# EAGLE board ESP32-P4 Display 7.0 inch V1.0 (EAGLE 9.6.2), part 1 of 3
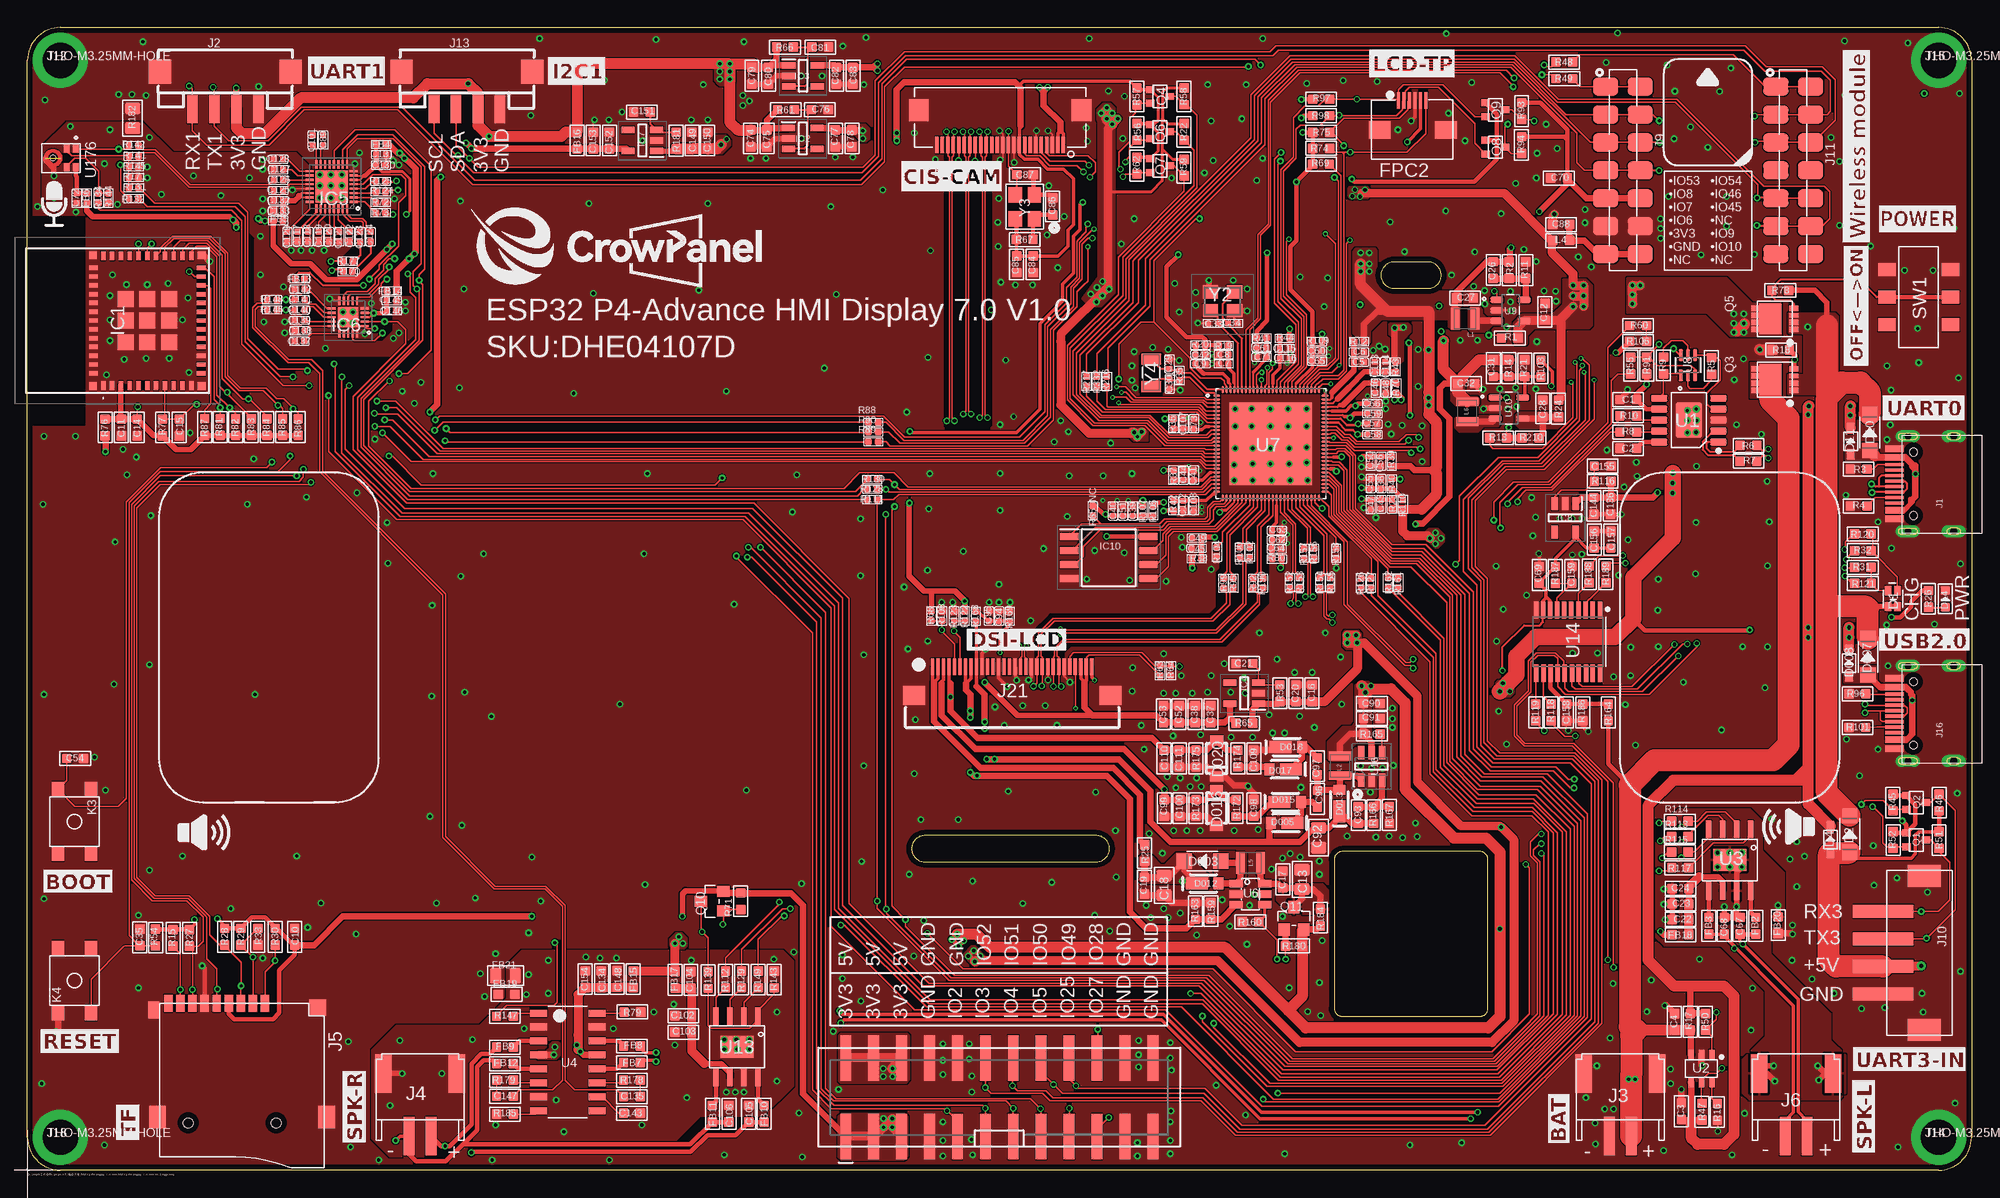
[diagram p9: board, top side]
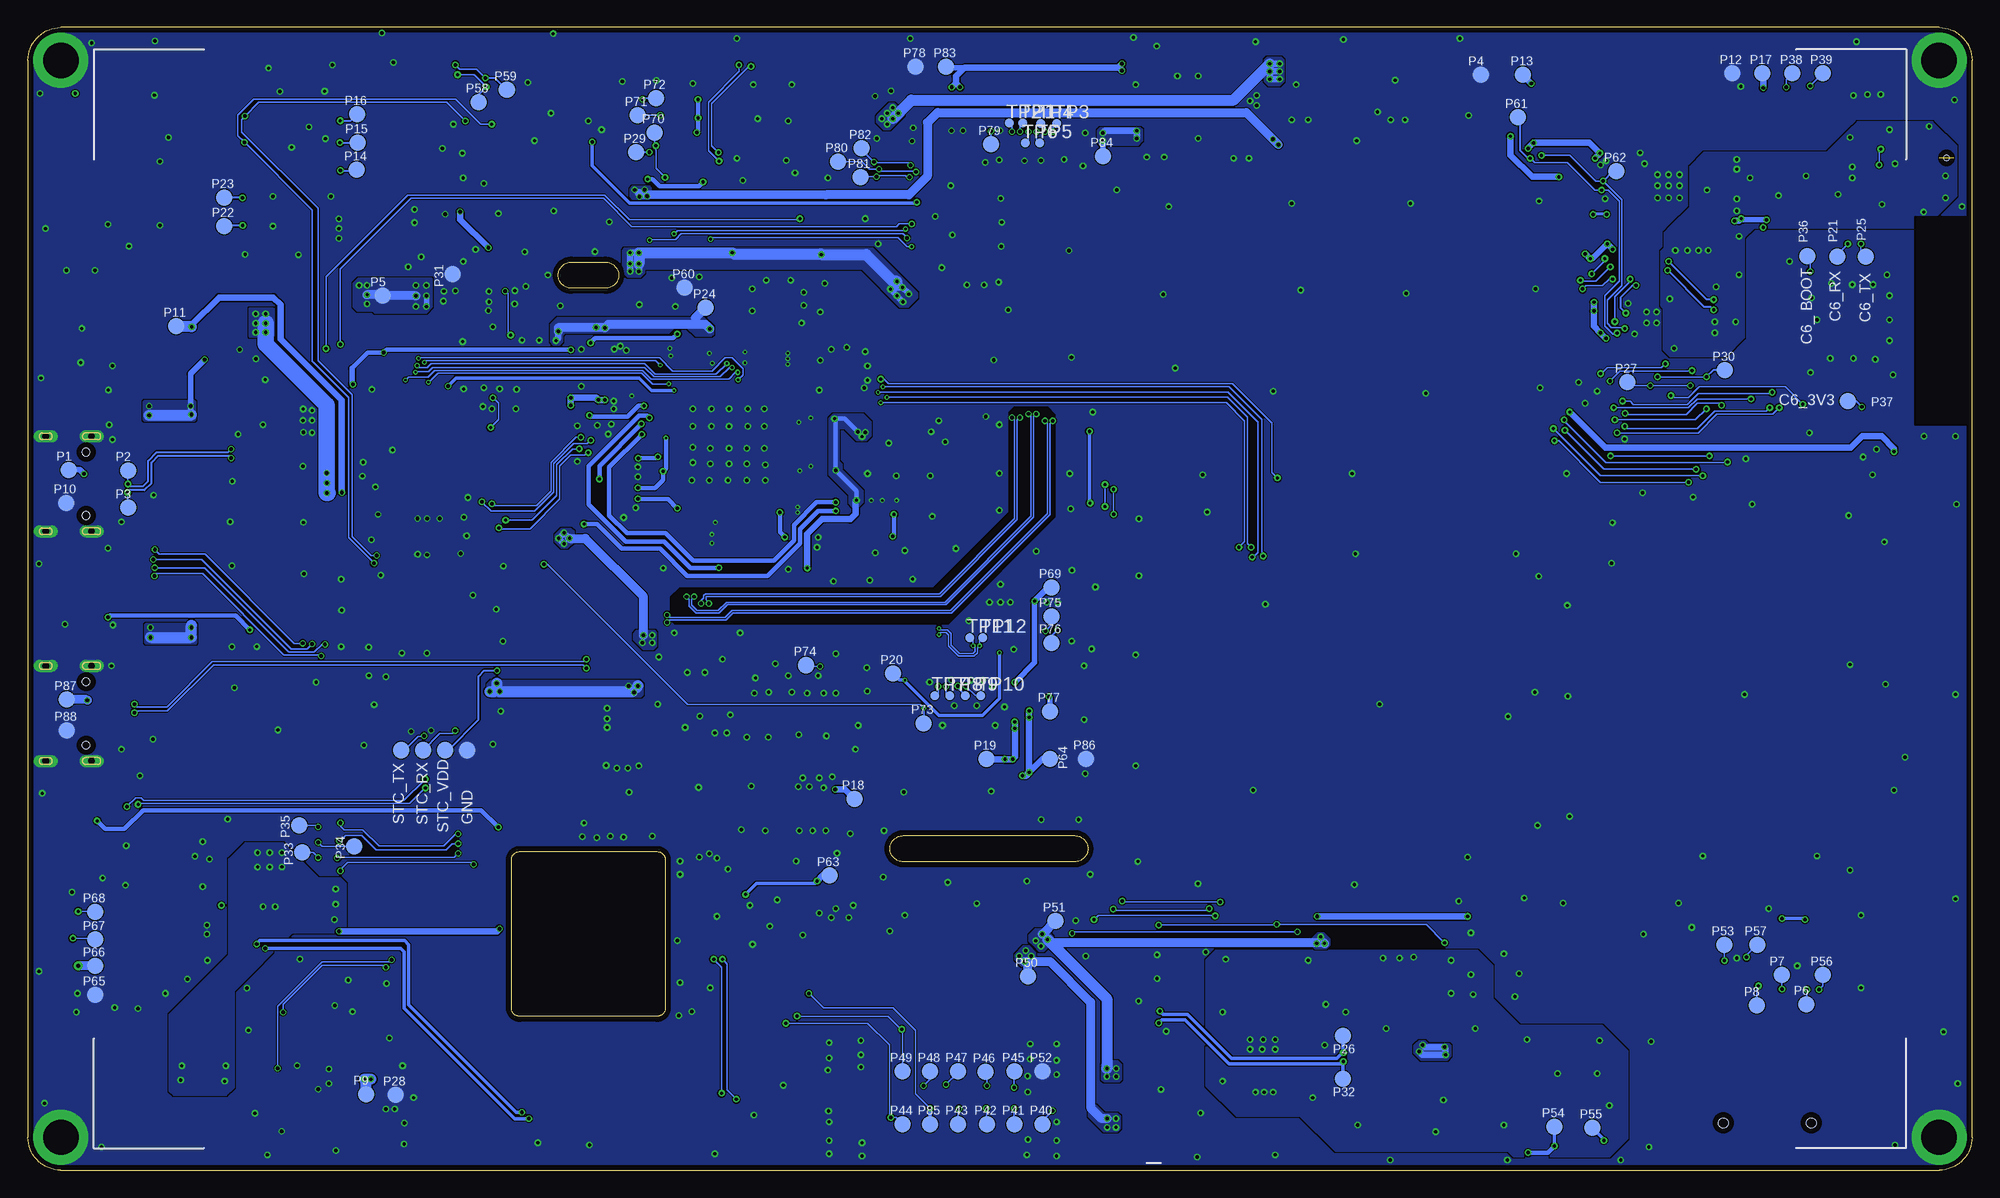
[diagram p10: board, bottom side, seen from below]

Size 176.9 x 104 mm. Coordinates in mm from the lower left corner, seen from the top.
Outline: 0,3 0,101 arc-90 3,104 173.9,104 arc-90 176.9,101 176.9,3 arc-90 173.9,0 3,0 arc-90 0,3
Outline: 81.64,28.07 97.27,28.07 arc180 97.27,30.45 81.64,30.45 arc180 81.64,28.07
Outline: 124.34,80.27 127.46,80.27 arc180 127.46,82.64 124.34,82.64 arc180 124.34,80.27
Outline: 119.65,14 132.15,14 arc90 132.9,14.75 132.9,28.25 arc90 132.15,29 119.65,29 arc90 118.9,28.25 118.9,14.75 arc90 119.65,14
Copper layers (1*16): Top 0.035mm / dielectric 1.5mm / Bottom 0.035mm
Design rules "default *": minimum track width 4mil, minimum drill 0.2mm, track to track 4mil, track to pad 6mil, pad to pad 6mil, via to via 6mil, smd to smd 6mil, copper to edge 20mil, drill to drill 6mil, minimum pad ring 10mil, minimum via ring 4mil, stop-mask expansion 4mil, vias tented up to drill 100mil, thermal gap 10mil

## Footprints (pad centres in the part's own frame; a part is rotated, then mirrored left to right if it is on the bottom)
0603 = smd 0.889 x 0.889: 1 -0.762,0; 2 0.762,0
C0402 = smd 0.6 x 0.6: 1 -0.45,0; 2 0.45,0
C0805 = smd 1.016 x 1.397: 1 -0.889,0; 2 0.889,0
LED_KT-0603RYG = smd 0.85 x 0.6: 1 0.725,-0.425; 2 0.725,0.425; 3 -0.725,-0.425; 4 -0.725,0.425
D_SOD123FL = smd 1.397 x 1.397: + -1.651,0; - 1.651,0
D_SOD323 = smd 1 x 0.8: + -1.2,0; - 1.2,0
LMBR140ET1G = smd 2 x 1.1: 1 -0.975,0 | smd 0.9 x 1.1: 2 0.975,0
LED0603 = smd 0.762 x 0.889: + -0.762,0; - 0.762,0
LMSZ5233BT1G = smd 0.91 x 1.22: 1 -1.635,0; 2 1.635,0
L0603 = smd 0.889 x 0.889: 1 -0.762,0; 2 0.762,0
L0402 = smd 0.635 x 0.635: 1 -0.445,0; 2 0.445,0
R0402 = smd 0.635 x 0.635: 1 -0.445,0; 2 0.445,0
L0805 = smd 1.016 x 1.397: 1 -0.889,0; 2 0.889,0
FPC-6PIN-0.5MM = smd 0.3 x 1.5: 1 -1.31,2.184; 2 -0.81,2.184; 3 -0.31,2.184; 4 0.19,2.184; 5 0.69,2.184; 6 1.19,2.184 | smd 2 x 1.6: 7 -3.01,-0.496; 8 3.036,-0.496
FPC-SMD_P0.50-24P_QCHF-SM-H2.0 = smd 0.3 x 1.5: 1 5.75,-1.574; 2 5.25,-1.574; 3 4.75,-1.574; 4 4.25,-1.574; 5 3.75,-1.574; 6 3.25,-1.574; 7 2.75,-1.574; 8 2.25,-1.574; 9 1.75,-1.574; 10 1.25,-1.574; 11 0.75,-1.574; 12 0.25,-1.574; 13 -0.25,-1.574; 14 -0.75,-1.574; 15 -1.25,-1.574; 16 -1.75,-1.574; 17 -2.25,-1.574; 18 -2.75,-1.574; 19 -3.25,-1.574; 20 -3.75,-1.574; 21 -4.25,-1.574; 22 -4.75,-1.574; 23 -5.25,-1.574; 24 -5.75,-1.574 | smd 1.8 x 2: 25 7.4,1.576; 26 -7.4,1.576
ESP32C6MINI1N4 = smd 0.8 x 0.4: 1 -5.9,4; 2 -5.9,3.2; 3 -5.9,2.4; 4 -5.9,1.6; 5 -5.9,0.8; 6 -5.9,0; 7 -5.9,-0.8; 8 -5.9,-1.6; 9 -5.9,-2.4; 10 -5.9,-3.2; 11 -5.9,-4; 25 5.9,-4; 26 5.9,-3.2; 27 5.9,-2.4; 28 5.9,-1.6; 29 5.9,-0.8; 30 5.9,0; 31 5.9,0.8; 32 5.9,1.6; 33 5.9,2.4; 34 5.9,3.2; 35 5.9,4 | smd 0.4 x 0.8: 12 -4.8,-4.9; 13 -4,-4.9; 14 -3.2,-4.9; 15 -2.4,-4.9; 16 -1.6,-4.9; 17 -0.8,-4.9; 18 0,-4.9; 19 0.8,-4.9; 20 1.6,-4.9; 21 2.4,-4.9; 22 3.2,-4.9; 23 4,-4.9; 24 4.8,-4.9; 36 4.8,4.9; 37 4,4.9; 38 3.2,4.9; 39 2.4,4.9; 40 1.6,4.9; 41 0.8,4.9; 42 0,4.9; 43 -0.8,4.9; 44 -1.6,4.9; 45 -2.4,4.9; 46 -3.2,4.9; 47 -4,4.9; 48 -4.8,4.9 | smd 1.45 x 1.45: 49 0,0; 54 -1.975,1.975; 55 -1.975,0; 56 -1.975,-1.975; 57 0,-1.975; 58 1.975,-1.975; 59 1.975,0; 60 1.975,1.975; 61 0,1.975 | smd 0.7 x 0.7: 50 5.95,4.95; 51 5.95,-4.95; 52 -5.95,-4.95; 53 -5.95,4.95
SOT95P282X145-5N = smd 1.2 x 0.6: 1 -1.3,0.95; 2 -1.3,0; 3 -1.3,-0.95; 4 1.3,-0.95; 5 1.3,0.95
QFN40P400X400X80-33N = smd 0.75 x 0.2: 1 -2,1.4; 2 -2,1; 3 -2,0.6; 4 -2,0.2; 5 -2,-0.2; 6 -2,-0.6; 7 -2,-1; 8 -2,-1.4; 17 2,-1.4; 18 2,-1; 19 2,-0.6; 20 2,-0.2; 21 2,0.2; 22 2,0.6; 23 2,1; 24 2,1.4 | smd 0.2 x 0.75: 9 -1.4,-2; 10 -1,-2; 11 -0.6,-2; 12 -0.2,-2; 13 0.2,-2; 14 0.6,-2; 15 1,-2; 16 1.4,-2; 25 1.4,2; 26 1,2; 27 0.6,2; 28 0.2,2; 29 -0.2,2; 30 -0.6,2; 31 -1,2; 32 -1.4,2 | smd 2.9 x 2.9: 33 0,0
QFN40P300X300X60-21N = smd 0.75 x 0.2: 1 -1.5,0.8; 2 -1.5,0.4; 3 -1.5,0; 4 -1.5,-0.4; 5 -1.5,-0.8; 11 1.5,-0.8; 12 1.5,-0.4; 13 1.5,0; 14 1.5,0.4; 15 1.5,0.8 | smd 0.2 x 0.75: 6 -0.8,-1.5; 7 -0.4,-1.5; 8 0,-1.5; 9 0.4,-1.5; 10 0.8,-1.5; 16 0.8,1.5; 17 0.4,1.5; 18 0,1.5; 19 -0.4,1.5; 20 -0.8,1.5 | smd 1.8 x 1.8: 21 0,0
SOIC127P790X216-8N = smd 1.65 x 0.65: 1 -3.6,1.905; 2 -3.6,0.635; 3 -3.6,-0.635; 4 -3.6,-1.905; 5 3.6,-1.905; 6 3.6,-0.635; 7 3.6,0.635; 8 3.6,1.905
USB-3.0TYPEC-SMD = smd 0.3 x 1.7: A1 -3.35,0.5; A4 -2.55,0.5; A5 -1.25,0.5; A6 -0.25,0.5; A7 0.25,0.5; A8 1.25,0.5; A9 2.55,0.5; A12 3.35,0.5; B1 3.05,0.5; B4 2.25,0.5; B5 1.75,0.5; B6 0.75,0.5; B7 -0.75,0.5; B8 -1.75,0.5; B9 -2.25,0.5; B12 -3.05,0.5 | drill 0.6 pad 1.016 long: P$1 -4.325,-0.72; P$2 4.325,-0.72; P$3 -4.325,-4.9; P$4 4.325,-4.9 | hole 0.68: -2.89,-1.22; 2.89,-1.22
CONNECTOR_4P-SMD-2.0 = smd 0.965 x 2.54: 1 -3,0; 2 -1,0; 3 1,0; 4 3,0 | smd 2.032 x 2.184: SS1 -5.946,3.4; SS2 5.946,3.4
PH2.0WT-2PIN = smd 1 x 3.5: P$1 -1,0; P$2 1,0 | smd 1.5 x 3.5: P$3 -3.35,-5.7; P$4 3.35,-5.7
9P-SMD-W/-RING = smd 1.524 x 0.762: 1 0,4.4; 2 0,3.3; 3 0,2.2; 4 0,1.1; 5 0,0; 6 0,-1.1; 7 0,-2.2; 8 0,-3.3; 9 0,-4.4 | smd 1.524 x 1.016: G1 0.6,-5.746 | smd 2.032 x 1.524: G2 10.373,-5.4; G3 10.373,10 | smd 1.524 x 1.524: G4 0.392,9.181 | hole 0.889: 10.9,-2.6; 10.9,5.4
2X12-SMD1 = smd 4.14 x 0.991: 1 -3.569,13.97; 2 3.569,13.97; 3 -3.569,11.43; 4 3.569,11.43; 5 -3.569,8.89; 6 3.569,8.89; 7 -3.569,6.35; 8 3.569,6.35; 9 -3.569,3.81; 10 3.569,3.81; 11 -3.569,1.27; 12 3.569,1.27; 13 -3.569,-1.27; 14 3.569,-1.27; 15 -3.569,-3.81; 16 3.569,-3.81; 17 -3.569,-6.35; 18 3.569,-6.35; 19 -3.569,-8.89; 20 3.569,-8.89; 21 -3.569,-11.43; 22 3.569,-11.43; 23 -3.569,-13.97; 24 3.569,-13.97
TEST-PIN-4-2.0MM = smd 1.5 x 1.5: 1 -3,0; 2 -1,0; 3 1,0; 4 3,0
H7-2.54-18.28X2.5X5MM = smd 1.65 x 2.3: 1 -7.62,-1.58; 1-1 -7.62,1.58; 2 -5.08,-1.58; 2-2 -5.08,1.58; 3 -2.54,-1.58; 3-3 -2.54,1.58; 4 0,-1.58; 4-4 0,1.58; 5 2.54,-1.58; 5-5 2.54,1.58; 6 5.08,-1.58; 6-6 5.08,1.58; 7 7.62,-1.58; 7-7 7.62,1.58
XH2.54-4P-SMD = smd 1.2 x 5.5: 1 -3.75,-1.875; 2 -1.25,-1.875; 3 1.25,-1.875; 4 3.75,-1.875 | smd 2 x 3: 5 -7,1.875; 6 7,1.875
THO-M3.2*5MM-HOLE = drill 3.2 pad 5: P$1 0,0
C23398852_30P_0.5MM_下接_FC-05A30P11H20 = smd 0.3 x 1.5: 1 -7.25,1.3; 2 -6.75,1.3; 3 -6.25,1.3; 4 -5.75,1.3; 5 -5.25,1.3; 6 -4.75,1.3; 7 -4.25,1.3; 8 -3.75,1.3; 9 -3.25,1.3; 10 -2.75,1.3; 11 -2.25,1.3; 12 -1.75,1.3; 13 -1.25,1.3; 14 -0.75,1.3; 15 -0.25,1.3; 16 0.25,1.3; 17 0.75,1.3; 18 1.25,1.3; 19 1.75,1.3; 20 2.25,1.3; 21 2.75,1.3; 22 3.25,1.3; 23 3.75,1.3; 24 4.25,1.3; 25 4.75,1.3; 26 5.25,1.3; 27 5.75,1.3; 28 6.25,1.3; 29 6.75,1.3; 30 7.25,1.3 | smd 2 x 1.7: 31 8.95,-1.3; 32 -8.95,-1.3
KEY-4.5X4.5-SMD = smd 1.35 x 1.1: 1 -2.925,1.5; 2 -2.925,-1.5; 3 2.925,-1.5; 4 2.925,1.5
1008(2520) = smd 0.8 x 2: 1 -0.9,0; 2 0.9,0
TEST_PAD-1.5MM = smd 1.5 x 1.5: P$1 0,0
MOS_SOT323 = smd 0.635 x 0.762: 1 -0.635,-0.889; 2 0.635,-0.889; 3 0,0.889
PDFN3333 = smd 0.5 x 0.8: 1 -0.975,-1.725; 2 -0.325,-1.725; 4 0.975,-1.725; 5 0.975,1.725; 6 0.325,1.725; 7 -0.325,1.725; 8 -0.975,1.725 | smd 0.4 x 0.8: 3 0.325,-1.725 | smd 2.8 x 2: 9 0,0.4
PMOS_SOT23 = smd 1.016 x 1.143: 1 -0.889,-1.016; 2 0.889,-1.016; 3 0,1.016
R0603 = smd 0.889 x 0.889: 1 -0.762,0; 2 0.762,0
R0603-SP = smd 0.889 x 0.889: 1 -0.762,0; 2 0.762,0
SWITCH_6PIN_2P = smd 1.2 x 1.6: 1 2.5,-2.9; 2 0,-2.9; 3 -2.5,-2.9; 4 -2.5,2.9; 5 0,2.9; 6 2.5,2.9
TP08R = smd 0.8 x 0.8: TP 0,0
ESOP-10-EP-150MIL = smd 1.5 x 0.6: 1 -2.7,2; 2 -2.7,1; 3 -2.7,0; 4 -2.7,-1; 5 -2.7,-2; 6 2.7,-2; 7 2.7,-1; 8 2.7,0; 9 2.7,1; 10 2.7,2 | smd 2.4 x 3.2: EP 0,0
SOT23-6L = smd 0.5 x 0.9: 1 -0.961,-1.212; 2 -0.011,-1.212; 3 0.94,-1.212; 4 0.94,1.288; 5 -0.011,1.288; 6 -0.961,1.288
NS4168-ESOP-8 = smd 1.6 x 0.5: 1 -2.8,1.905; 2 -2.8,0.635; 3 -2.8,-0.635; 4 -2.8,-1.905; 5 2.8,-1.905; 6 2.8,-0.635; 7 2.8,0.635; 8 2.8,1.905 | smd 2 x 3: 9 0,0
SOP16 = smd 0.635 x 1.524: 1 0,0; 2 1.27,0; 3 2.54,0; 4 3.81,0; 5 5.08,0; 6 6.35,0; 7 7.62,0; 8 8.89,0; 9 8.89,5.334; 10 7.62,5.334; 11 6.35,5.334; 12 5.08,5.334; 13 3.81,5.334; 14 2.54,5.334; 15 1.27,5.334; 16 0,5.334
COOPER_SOT23-6 = smd 0.69 x 1.2: 1 -0.95,-1.3; 2 0,-1.3; 3 0.95,-1.3; 4 0.95,1.3; 5 0,1.3; 6 -0.95,1.3
IC_ESP32-P4NRW32 = smd 0.65 x 0.18: 1 -4.925,4.375; 2 -4.925,4.025; 3 -4.925,3.675; 4 -4.925,3.325; 5 -4.925,2.975; 6 -4.925,2.625; 7 -4.925,2.275; 8 -4.925,1.925; 9 -4.925,1.575; 10 -4.925,1.225; 11 -4.925,0.875; 12 -4.925,0.525; 13 -4.925,0.175; 14 -4.925,-0.175; 15 -4.925,-0.525; 16 -4.925,-0.875; 17 -4.925,-1.225; 18 -4.925,-1.575; 19 -4.925,-1.925; 20 -4.925,-2.275; 21 -4.925,-2.625; 22 -4.925,-2.975; 23 -4.925,-3.325; 24 -4.925,-3.675; 25 -4.925,-4.025; 26 -4.925,-4.375; 53 4.925,-4.375; 54 4.925,-4.025; 55 4.925,-3.675; 56 4.925,-3.325; 57 4.925,-2.975; 58 4.925,-2.625; 59 4.925,-2.275; 60 4.925,-1.925; 61 4.925,-1.575; 62 4.925,-1.225; 63 4.925,-0.875; 64 4.925,-0.525; 65 4.925,-0.175; 66 4.925,0.175; 67 4.925,0.525; 68 4.925,0.875; 69 4.925,1.225; 70 4.925,1.575; 71 4.925,1.925; 72 4.925,2.275; 73 4.925,2.625; 74 4.925,2.975; 75 4.925,3.325; 76 4.925,3.675; 77 4.925,4.025; 78 4.925,4.375 | smd 0.18 x 0.65: 27 -4.375,-4.925; 28 -4.025,-4.925; 29 -3.675,-4.925; 30 -3.325,-4.925; 31 -2.975,-4.925; 32 -2.625,-4.925; 33 -2.275,-4.925; 34 -1.925,-4.925; 35 -1.575,-4.925; 36 -1.225,-4.925; 37 -0.875,-4.925; 38 -0.525,-4.925; 39 -0.175,-4.925; 40 0.175,-4.925; 41 0.525,-4.925; 42 0.875,-4.925; 43 1.225,-4.925; 44 1.575,-4.925; 45 1.925,-4.925; 46 2.275,-4.925; 47 2.625,-4.925; 48 2.975,-4.925; 49 3.325,-4.925; 50 3.675,-4.925; 51 4.025,-4.925; 52 4.375,-4.925; 79 4.375,4.925; 80 4.025,4.925; 81 3.675,4.925; 82 3.325,4.925; 83 2.975,4.925; 84 2.625,4.925; 85 2.275,4.925; 86 1.925,4.925; 87 1.575,4.925; 88 1.225,4.925; 89 0.875,4.925; 90 0.525,4.925; 91 0.175,4.925; 92 -0.175,4.925; 93 -0.525,4.925; 94 -0.875,4.925; 95 -1.225,4.925; 96 -1.575,4.925; 97 -1.925,4.925; 98 -2.275,4.925; 99 -2.625,4.925; 100 -2.975,4.925; 101 -3.325,4.925; 102 -3.675,4.925; 103 -4.025,4.925; 104 -4.375,4.925 | smd 7.5 x 7.5: 105 0,0
SOP65P210X100-6N = smd 1.09 x 0.4: 1 -0.92,0.65; 2 -0.92,0; 3 -0.92,-0.65; 4 0.92,-0.65; 5 0.92,0; 6 0.92,0.65
SOT95P280X145-5N = smd 1.21 x 0.59: 1 -1.255,0.95; 2 -1.255,0; 3 -1.255,-0.95; 4 1.255,-0.95; 5 1.255,0.95
TSSOP20 = smd 1.572 x 0.41: 1 -2.872,2.275; 2 -2.872,1.625; 3 -2.872,0.975; 4 -2.872,0.325; 5 -2.872,-0.325; 6 -2.872,-0.975; 7 -2.872,-1.625; 8 -2.872,-2.275; 9 -2.872,-2.895; 10 -2.872,-3.545; 11 2.872,-3.515; 12 2.872,-2.865; 13 2.872,-2.215; 14 2.872,-1.565; 15 2.872,-0.915; 16 2.872,-0.265; 17 2.872,0.355; 18 2.872,1.005; 19 2.872,1.625; 20 2.872,2.275
SOT95P280X145-6N = smd 1.2 x 0.6: 1 -1.25,0.95; 2 -1.25,0; 3 -1.25,-0.95; 4 1.25,-0.95; 5 1.25,0; 6 1.25,0.95
MIC-SMD_5P-L3.5-W2.7-P1.67 = smd 0.725 x 0.522: 1 -0.838,1.362; 2 -0.838,0.542; 3 0.838,0.542; 4 0.838,1.362 | smd 0.25 x 0.25: 5_1 0,-0.048; 5_2 0,-1.373 | hole 0.5: 0,-0.71
X322540MPB4SI = smd 1.4 x 1.2: 1 -1.1,-0.85; 2 1.1,-0.85; 3 1.1,0.85; 4 -1.1,0.85
24MHZ_1631-24003-BTKEYA = smd 1.4 x 1.2: 1 -1.1,-0.875; 2 1.1,-0.875; 3 1.1,0.875; 4 -1.1,0.875
NORDIC_NRF_XTAL_3215_N = smd 1 x 1.8: 1 -1.25,0; 2 1.25,0

## Placement (x,y rotation side)
C1  1uF  [0603]  145.65,70.14 0 top
C2  1uF  [0603]  145.65,65.69 0 top
C3  1uF  [0603]  150.49,5.37 270 top
C4  10uF/NC  [0603]  149.86,13.51 270 top
C5  100nF  [C0402]  121.14,73.55 0 top
C6  10uF  [C0402]  121.16,74.45 180 top
C7  100nF  [C0402]  108.85,73.38 180 top
C8  10uF  [C0402]  108.85,74.22 0 top
C9  100nF  [C0402]  106.74,73.39 0 top
C10  1uF  [0603]  24.32,21.24 270 top
C11  100nF  [0603]  8.55,67.6 270 top
C12  10uF/10V+  [0603]  138.08,78.13 90 top
C13  22uF  [C0805]  115.97,26.46 90 top
C14  10uF  [0603]  9.98,67.6 90 top
C15  100nF  [0603]  13.82,67.6 270 top
C16  10uF  [0603]  116.89,43.4 270 top
C17  1uF  [0603]  114.22,26.46 270 top
C18  22uF  [C0805]  103.43,25.92 270 top
C19  100nF  [0603]  101.64,25.89 270 top
C20  100nF  [0603]  115.42,43.4 270 top
C21  100nF  [0603]  110.72,46.12 0 top
C22  1uF  [0603]  150.41,22.81 180 top
C23  47uF  [0603]  150.41,24.24 180 top
C24  47uF  [0603]  150.41,25.64 180 top
C26  22pF  [0603]  133.37,81.93 90 top
C27  10uF/10V+  [0603]  130.81,79.39 180 top
C28  10uF/10V+  [0603]  137.88,69.33 90 top
C29  12pF  [C0402]  103.92,73.38 90 top
C30  12pF  [C0402]  103.93,71.55 270 top
C31  22pF  [0603]  133.39,73 90 top
C32  10uF/10V+  [0603]  130.91,71.59 180 top
C33  15pF  [C0402]  107.87,77.07 180 top
C34  15pF  [C0402]  109.71,77.07 180 top
C35  100nF  [0603]  10.23,21.19 270 top
C36  100nF  [C0402]  123.17,62.48 90 top
C37  100nF  [0603]  107.68,41.5 270 top
C38  10uF  [0603]  106.24,41.5 270 top
C39  100nF_NC  [C0402]  100.57,60.01 90 top
C40  100nF  [C0402]  98.77,60.01 90 top
C41  100nF  [C0402]  106.15,63.26 90 top
C42  10uF  [C0402]  106.75,74.23 180 top
C43  100nF  [C0402]  123.17,60.61 270 top
C44  10uF  [C0402]  105.2,63.26 270 top
C45  100nF  [C0402]  106.39,56.61 180 top
C46  100nF  [C0402]  122.67,71.17 270 top
C47  10uF  [C0402]  122.23,60.6 90 top
C48  10uF  [C0402]  123.6,71.17 90 top
C49  10uF  [C0402]  106.39,57.53 0 top
C50  100nF  [C0402]  122.23,64.52 270 top
C51  1uF  [C0402]  99.67,60.01 90 top
C52  100nF  [0603]  104.8,41.5 270 top
C53  100nF  [0603]  103.36,41.5 270 top
C54  100nF  [0603]  4.34,37.47 180 top
C55  1uF  [C0402]  122.23,62.5 90 top
C56  10uF  [C0402]  123.17,64.52 90 top
C57  1uF  [C0402]  122.38,67.91 0 top
C58  1uF  [C0402]  122.38,66.95 0 top
C59  1uF  [C0402]  122.37,68.85 0 top
C60  100nF  [C0402]  117.35,74.56 0 top
C61  100nF  [C0402]  112.3,74.87 180 top
C62  10nF  [C0402]  113.68,57.36 0 top
C63  100nF  [C0402]  113.68,58.23 0 top
C64  1uF  [C0402]  113.67,56.53 0 top
C65  1uF  [C0402]  117.35,73.64 0 top
C66  1uF  [C0402]  122.37,69.77 0 top
C67  1nF  [0603]  155.82,22.25 270 top
C68  1nF  [0603]  154.4,22.25 270 top
C69  1uF  [0603]  137.55,54.18 270 top
C70  10UF  [0603]  139.36,90.3 180 top
C71  10uF  [C0402]  112.3,74 0 top
C72  100nF  [C0402]  4.48,88.46 90 top
C73  100nF  [C0402]  106.15,67.94 90 top
C74  10uF  [0603]  65.81,93.9 90 top
C75  100nF  [0603]  67.28,93.9 90 top
C76  100nF  [0603]  72.1,96.52 180 top
C77  100nF  [0603]  73.52,93.9 90 top
C78  10uF  [0603]  75.01,93.9 90 top
C79  10uF  [0603]  65.91,99.6 90 top
C80  100nF  [0603]  67.42,99.6 90 top
C81  100nF  [0603]  72.13,102.22 180 top
C82  100nF  [0603]  73.61,99.6 90 top
C83  10uF  [0603]  75.11,99.6 90 top
C84  100nF  [0603]  91.51,82.44 90 top
C85  1nF  [0603]  90.01,82.44 90 top
C86  1uF  [0603]  93.29,87.72 270 top
C87  15pF  [0603]  90.77,90.61 180 top
C88  10UF_NC  [0603]  139.55,86.07 180 top
C89  22pF_NC  [C0402]  26.92,93.76 90 top
C90  10uF/25V  [0603]  122.33,42.48 0 top
C91  100nF/50V  [0603]  122.33,41.11 0 top
C92  22uF/16V  [C0805]  117.48,30.26 270 top
C93  10nF/25V  [0603]  121.09,32.32 90 top
C94  10uF/25V  [C0402]  88.42,50.42 90 top
C95  100nF/50V  [C0402]  87.49,50.42 90 top
C96  1uF/25V  [0603]  117.38,33.8 270 top
C97  1uF/25V  [0603]  117.37,36.76 90 top
C98  1uF/50V  [0603]  111.59,32.96 90 top
C99  10uF/25V  [0603]  103.45,32.96 270 top
C100  100nF/50V  [0603]  104.87,32.96 270 top
C101  22pF_NC  [C0402]  25.96,93.76 90 top
C102  1uF  [0603]  59.67,14.06 180 top
C103  47uF  [0603]  59.67,12.56 180 top
C104  47uF  [0603]  60.36,17.33 90 top
C105  1nF  [0603]  65.62,5.15 270 top
C106  1nF  [0603]  63.83,5.15 270 top
C107  10uF  [C0402]  105.2,67.94 270 top
C108  100nF  [C0402]  106.15,60.48 270 top
C109  1uF/50V  [0603]  111.58,37.47 90 top
C110  10uF/25V  [0603]  103.41,37.47 270 top
C111  100nF/50V  [0603]  104.81,37.47 270 top
C112  10uF  [C0402]  105.2,60.48 90 top
C113  100nF  [C0402]  122.6,73.12 90 top
C114  10uF  [C0402]  123.54,73.12 270 top
C115  100nF  [C0402]  114.4,74.79 0 top
C116  10uF  [C0402]  114.41,73.87 180 top
C117  1uF_NC  [C0402]  24.61,84.96 90 top
C118  1uF_NC  [C0402]  25.55,84.96 90 top
C119  1uF_NC  [C0402]  26.5,84.96 90 top
C120  1uF_NC  [C0402]  27.44,84.96 90 top
C121  1uF_NC  [C0402]  28.39,84.96 90 top
C122  1uF_NC  [C0402]  29.33,84.96 90 top
C123  1uF_NC  [C0402]  30.28,84.96 90 top
C124  1uF_NC  [C0402]  31.22,84.96 90 top
C125  1uF_NC  [C0402]  22.84,89.17 180 top
C126  1uF_NC  [C0402]  22.84,90.11 180 top
C127  1uF_NC  [C0402]  22.84,91.06 180 top
C128  1uF_NC  [C0402]  22.84,92 180 top
C129  1uF_NC  [C0402]  23.65,84.96 270 top
C130  100nF_NC  [C0402]  32.16,91.47 0 top
C131  1uF_NC  [C0402]  32.18,92.42 180 top
C132  100nF_NC  [C0402]  22.83,88.23 180 top
C133  1uF_NC  [C0402]  22.82,87.32 0 top
C134  47uF_NC  [0603]  52.23,17.39 270 top
C135  100nF_NC  [0603]  55,6.7 0 top
C136  10uF  [0603]  144.05,60.46 90 top
C137  1uF_NC  [C0402]  24.74,75.45 0 top
C138  1uF_NC  [C0402]  24.76,76.4 180 top
C139  1uF_NC  [C0402]  24.76,77.34 180 top
C140  1uF_NC  [C0402]  24.76,78.29 180 top
C141  1uF_NC  [C0402]  24.76,79.23 180 top
C142  1uF_NC  [C0402]  24.76,80.18 180 top
C143  1uF_NC  [0603]  55,5.2 180 top
C144  100nF  [0603]  142.53,60.46 90 top
C145  100nF_NC  [C0402]  33.14,79.13 0 top
C146  1uF_NC  [C0402]  33.16,78.21 180 top
C147  100nF_NC  [0603]  43.45,6.72 180 top
C148  47uF_NC  [0603]  53.65,17.41 270 top
C149  10uF  [0603]  60.46,93.71 270 top
C150  100nF  [0603]  61.9,93.71 270 top
C151  100nF  [0603]  55.91,96.31 0 top
C152  100nF  [0603]  52.95,93.71 270 top
C153  10uF  [0603]  51.49,93.71 270 top
C154  100nF_NC  [0603]  50.75,17.39 90 top
C155  100nF  [0603]  143.33,64.09 180 top
C156  100nF  [0603]  142.56,57.39 270 top
C157  10uF  [0603]  144.08,57.39 270 top
C158  1nF  [0603]  140.04,41.66 90 top
C159  100nF  [0603]  140.52,54.18 270 top
D1  KT-0603RYG  [LED_KT-0603RYG]  169.74,52.03 270 top
D2  DSS34  [D_SOD123FL]  165.81,30.6 90 top
D003  NC/DSS34  [D_SOD123FL]  106.91,28.12 180 top
D4  1N5817WS  [D_SOD323]  164.06,30.09 90 top
D005  LMBR140ET1G  [LMBR140ET1G]  114.11,31.61 180 top
D007  DSS34  [D_SOD123FL]  167.47,46.72 90 top
D008  1N5817WS  [D_SOD323]  165.75,46.15 90 top
D10  DSS34  [D_SOD123FL]  167.63,67.14 90 top
D11  1N5817WS  [D_SOD323]  165.9,66.35 90 top
D012  LMBR140ET1G  [LMBR140ET1G]  107.41,26.09 0 top
D013  LMBR140ET1G  [LMBR140ET1G]  119.39,33.65 90 top
D14  Red  [LED0603]  174.52,52 90 top
D015  LMBR140ET1G  [LMBR140ET1G]  114.89,33.51 0 top
D016  MM1W18_18V  [LMSZ5233BT1G]  108.19,32.96 270 top
D017  LMBR140ET1G  [LMBR140ET1G]  113.99,36.49 180 top
D018  LMBR140ET1G  [LMBR140ET1G]  114.99,38.51 0 top
D020  LMSZ5233BT1G_-6V  [LMSZ5233BT1G]  108.21,37.47 90 top
FB2  1K/磁珠  [L0603]  157.27,22.25 270 top
FB3  1K/磁珠  [L0603]  152.99,22.25 270 top
FB4  0R/800mA_NC  [L0402]  32.18,93.36 180 top
FB5  0R/800mA_NC  [L0402]  22.81,86.41 0 top
FB6  0R/800mA  [L0402]  5.4,88.46 90 top
FB7  1K/磁珠_NC  [L0603]  55,9.8 0 top
FB8  1K/磁珠_NC  [L0603]  55,11.3 0 top
FB9  1K/磁珠_NC  [L0603]  43.45,11.2 180 top
FB10  1K/磁珠  [L0603]  67.02,5.15 270 top
FB11  1K/磁珠  [L0603]  62.33,5.15 270 top
FB12  1K/磁珠_NC  [L0603]  43.45,9.7 180 top
FB13  0R/800mA_NC  [L0402]  24.76,81.14 180 top
FB14  0R/800mA_NC  [R0402]  33.14,80.03 180 top
FB15  0R/800mA_NC  [L0603]  55.12,17.39 270 top
FB16  0R/800mA_NC  [L0603]  50.01,93.71 270 top
FB17  0R/800mA  [L0603]  58.93,17.33 90 top
FB18  0R/800mA  [L0603]  150.41,21.43 180 top
FB19  0R/800mA  [L0603]  43.6,16 0 top
FB20  0R/800mA  [L0603]  159.3,22.3 90 top
FB21  0R/800mA  [L0805]  43.5,17.7 0 top
FPC2  FPC-6PIN-0.5MM  [FPC-6PIN-0.5MM]  126.05,95.18 0 top
FPC3  AFC24-S24FIA-00  [FPC-SMD_P0.50-24P_QCHF-SM-H2.0]  88.5,94.9 0 top
IC1  ESP32-C6-MINI-1-N4  [ESP32C6MINI1N4]  10.91,77.32 90 top
IC2  ME6211C18M5G-N  [SOT95P282X145-5N]  70.56,93.9 0 top
IC3  ME6211C28M5G-N  [SOT95P282X145-5N]  70.57,99.6 0 top
IC4  ME6211C18M5G-N_NC  [SOT95P282X145-5N]  110.72,43.4 180 top
IC5  ES7210_NC  [QFN40P400X400X80-33N]  27.69,89.53 180 top
IC6  ES8311_NC  [QFN40P300X300X60-21N]  29.19,77.63 180 top
IC7  ME6211C33M5G-N  [SOT95P282X145-5N]  55.94,93.71 180 top
IC8  ME6211C33M5G-N  [SOT95P282X145-5N]  139.92,59.37 270 top
IC10  W25Q128JVSIQ  [SOIC127P790X216-8N]  98.39,55.76 0 top
J1  TYPEC-3.0-16P-SMD  [USB-3.0TYPEC-SMD]  170.38,62.47 90 top
J2  HY2.0-4P-SMT  [CONNECTOR_4P-SMD-2.0]  18,96.57 0 top
J3  PH2.0WT-2PIN  [PH2.0WT-2PIN]  144.93,3.11 180 top
J4  PH2.0WT-2PIN  [PH2.0WT-2PIN]  35.72,3.11 180 top
J5  [9P-SMD-W/-RING]  17.22,15.2 270 top
J6  PH2.0WT-2PIN  [PH2.0WT-2PIN]  160.93,3.11 180 top
J7  CONN_12X22X12-SMD1  [2X12-SMD1]  88.43,6.64 90 top
J8  HC-PZ200-8.7L-1X4PZ1  [TEST-PIN-4-2.0MM]  139.95,38.23 0 bottom
J9  [H7-2.54-18.28X2.5X5MM]  145.17,91 270 top
J10  XH2.54-4P-SMT  [XH2.54-4P-SMD]  170.73,19.8 270 top
J11  [H7-2.54-18.28X2.5X5MM]  160.67,91 270 top
J12  THO-M3.25MM-HOLE  [THO-M3.2*5MM-HOLE]  3,101 0 top
J13  HY2.0-4P-SMT  [CONNECTOR_4P-SMD-2.0]  40,96.57 0 top
J14  THO-M3.25MM-HOLE  [THO-M3.2*5MM-HOLE]  173.9,3 0 top
J15  THO-M3.25MM-HOLE  [THO-M3.2*5MM-HOLE]  173.9,101 0 top
J16  TYPEC-3.0-16P-SMD  [USB-3.0TYPEC-SMD]  170.38,41.57 90 top
J18  THO-M3.25MM-HOLE  [THO-M3.2*5MM-HOLE]  3,3 0 top
J21  C23398852_30P_0.5MM_下接_FC-05A30P11H20  [C23398852_30P_0.5MM_下接_FC-05A30P11H20]  89.6,44.51 0 top
K3  KEY-4.5X4.5  [KEY-4.5X4.5-SMD]  4.28,31.74 270 top
K4  KEY-4.5X4.5  [KEY-4.5X4.5-SMD]  4.28,17.25 90 top
L1  2.2μH_C5179446  [1008(2520)]  130.8,77.49 180 top
L2  4.7uH_C45385206_2.4A  [1008(2520)]  119.42,36.8 270 top
L4  NC  [L0603]  139.56,84.62 180 top
L5  4.7uH_C45385206_2.4A  [1008(2520)]  111.28,27.97 180 top
L6  2.2μH_C5179446  [1008(2520)]  131.01,69.04 90 top
P1  TEST_PADPAD-1.5MM  [TEST_PAD-1.5MM]  173.17,63.72 0 bottom
P2  TEST_PADPAD-1.5MM  [TEST_PAD-1.5MM]  167.78,63.69 0 bottom
P3  TEST_PADPAD-1.5MM  [TEST_PAD-1.5MM]  167.79,60.29 0 bottom
P4  TEST_PADPAD-1.5MM  [TEST_PAD-1.5MM]  44.7,99.69 0 bottom
P5  TEST_PADPAD-1.5MM  [TEST_PAD-1.5MM]  144.61,79.59 0 bottom
P6  TEST_PADPAD-1.5MM  [TEST_PAD-1.5MM]  15.08,15.1 0 bottom
P7  TEST_PADPAD-1.5MM  [TEST_PAD-1.5MM]  17.29,17.76 0 bottom
P8  TEST_PADPAD-1.5MM  [TEST_PAD-1.5MM]  19.6,15 0 bottom
P9  TEST_PADPAD-1.5MM  [TEST_PAD-1.5MM]  146.14,6.92 0 bottom
P10  TEST_PADPAD-1.5MM  [TEST_PAD-1.5MM]  173.42,60.74 0 bottom
P11  TEST_PADPAD-1.5MM  [TEST_PAD-1.5MM]  163.42,76.81 0 bottom
P12  TEST_PADPAD-1.5MM  [TEST_PAD-1.5MM]  21.82,99.82 0 bottom
P13  TEST_PADPAD-1.5MM  [TEST_PAD-1.5MM]  40.85,99.7 0 bottom
P14  TEST_PADPAD-1.5MM  [TEST_PAD-1.5MM]  146.98,91.04 0 bottom
P15  TEST_PADPAD-1.5MM  [TEST_PAD-1.5MM]  146.89,93.52 0 bottom
P16  TEST_PADPAD-1.5MM  [TEST_PAD-1.5MM]  146.94,96.1 0 bottom
P17  TEST_PADPAD-1.5MM  [TEST_PAD-1.5MM]  19.08,99.82 0 bottom
P18  TEST_PADPAD-1.5MM  [TEST_PAD-1.5MM]  101.7,33.8 0 bottom
P19  TEST_PADPAD-1.5MM  [TEST_PAD-1.5MM]  89.68,37.41 0 bottom
P20  TEST_PADPAD-1.5MM  [TEST_PAD-1.5MM]  98.19,45.21 0 bottom
P21  TEST_PADPAD-1.5MM  [TEST_PAD-1.5MM]  12.26,83.13 90 bottom
P22  TEST_PADPAD-1.5MM  [TEST_PAD-1.5MM]  159.03,85.91 0 bottom
P23  TEST_PADPAD-1.5MM  [TEST_PAD-1.5MM]  159.06,88.53 0 bottom
P24  TEST_PADPAD-1.5MM  [TEST_PAD-1.5MM]  115.23,78.51 0 bottom
P25  TEST_PADPAD-1.5MM  [TEST_PAD-1.5MM]  9.66,83.13 90 bottom
P26  TEST_PADPAD-1.5MM  [TEST_PAD-1.5MM]  57.26,12.22 180 bottom
P27  TEST_PADPAD-1.5MM  [TEST_PAD-1.5MM]  31.35,71.71 0 bottom
P28  TEST_PADPAD-1.5MM  [TEST_PAD-1.5MM]  143.44,6.85 0 bottom
P29  TEST_PADPAD-1.5MM  [TEST_PAD-1.5MM]  121.56,92.64 0 bottom
P30  TEST_PADPAD-1.5MM  [TEST_PAD-1.5MM]  22.48,72.81 0 bottom
P31  TEST_PADPAD-1.5MM  [TEST_PAD-1.5MM]  138.25,81.53 90 bottom
P32  TEST_PADPAD-1.5MM  [TEST_PAD-1.5MM]  57.27,8.32 180 bottom
P33  TEST_PADPAD-1.5MM  [TEST_PAD-1.5MM]  151.93,28.91 90 bottom
P34  TEST_PADPAD-1.5MM  [TEST_PAD-1.5MM]  147.22,29.49 90 bottom
P35  TEST_PADPAD-1.5MM  [TEST_PAD-1.5MM]  152.23,31.4 90 bottom
P36  TEST_PADPAD-1.5MM  [TEST_PAD-1.5MM]  14.98,83.2 0 bottom
P37  TEST_PADPAD-1.5MM  [TEST_PAD-1.5MM]  11.3,69.98 0 bottom
P38  TEST_PADPAD-1.5MM  [TEST_PAD-1.5MM]  16.33,99.82 0 bottom
P39  TEST_PADPAD-1.5MM  [TEST_PAD-1.5MM]  13.59,99.82 0 bottom
P40  TEST_PADPAD-1.5MM  [TEST_PAD-1.5MM]  84.6,4.2 0 bottom
P41  TEST_PADPAD-1.5MM  [TEST_PAD-1.5MM]  87.12,4.2 0 bottom
P42  TEST_PADPAD-1.5MM  [TEST_PAD-1.5MM]  89.64,4.2 0 bottom
P43  TEST_PADPAD-1.5MM  [TEST_PAD-1.5MM]  92.28,4.2 0 bottom
P44  TEST_PADPAD-1.5MM  [TEST_PAD-1.5MM]  97.32,4.2 0 bottom
P45  TEST_PADPAD-1.5MM  [TEST_PAD-1.5MM]  87.12,9 0 bottom
P46  TEST_PADPAD-1.5MM  [TEST_PAD-1.5MM]  89.78,8.95 0 bottom
P47  TEST_PADPAD-1.5MM  [TEST_PAD-1.5MM]  92.28,9 0 bottom
P48  TEST_PADPAD-1.5MM  [TEST_PAD-1.5MM]  94.8,9 0 bottom
P49  TEST_PADPAD-1.5MM  [TEST_PAD-1.5MM]  97.32,9 0 bottom
P50  TEST_PADPAD-1.5MM  [TEST_PAD-1.5MM]  85.92,17.64 0 bottom
P51  TEST_PADPAD-1.5MM  [TEST_PAD-1.5MM]  83.4,22.68 0 bottom
P52  TEST_PADPAD-1.5MM  [TEST_PAD-1.5MM]  84.6,9 0 bottom
P53  TEST_PADPAD-1.5MM  [TEST_PAD-1.5MM]  22.56,20.52 0 bottom
P54  TEST_PADPAD-1.5MM  [TEST_PAD-1.5MM]  38,3.97 0 bottom
P55  TEST_PADPAD-1.5MM  [TEST_PAD-1.5MM]  34.56,3.86 0 bottom
P56  TEST_PADPAD-1.5MM  [TEST_PAD-1.5MM]  13.56,17.76 0 bottom
P57  TEST_PADPAD-1.5MM  [TEST_PAD-1.5MM]  19.56,20.52 0 bottom
P58  TEST_PADPAD-1.5MM  [TEST_PAD-1.5MM]  135.91,97.22 0 bottom
P59  TEST_PADPAD-1.5MM  [TEST_PAD-1.5MM]  133.32,98.32 0 bottom
P60  TEST_PADPAD-1.5MM  [TEST_PAD-1.5MM]  117.13,80.32 0 bottom
P61  TEST_PADPAD-1.5MM  [TEST_PAD-1.5MM]  41.34,95.82 0 bottom
P62  TEST_PADPAD-1.5MM  [TEST_PAD-1.5MM]  32.35,90.92 0 bottom
P63  TEST_PADPAD-1.5MM  [TEST_PAD-1.5MM]  103.96,26.82 0 bottom
P64  TEST_PADPAD-1.5MM  [TEST_PAD-1.5MM]  83.92,37.43 270 bottom
P65  TEST_PADPAD-1.5MM  [TEST_PAD-1.5MM]  170.76,15.96 0 bottom
P66  TEST_PADPAD-1.5MM  [TEST_PAD-1.5MM]  170.76,18.6 0 bottom
P67  TEST_PADPAD-1.5MM  [TEST_PAD-1.5MM]  170.76,21 0 bottom
P68  TEST_PADPAD-1.5MM  [TEST_PAD-1.5MM]  170.76,23.52 0 bottom
P69  TEST_PADPAD-1.5MM  [TEST_PAD-1.5MM]  83.76,53.04 0 bottom
P70  TEST_PADPAD-1.5MM  [TEST_PAD-1.5MM]  119.88,94.44 0 bottom
P71  TEST_PADPAD-1.5MM  [TEST_PAD-1.5MM]  121.44,96 0 bottom
P72  TEST_PADPAD-1.5MM  [TEST_PAD-1.5MM]  119.76,97.56 0 bottom
P73  TEST_PADPAD-1.5MM  [TEST_PAD-1.5MM]  95.4,40.68 0 bottom
P74  TEST_PADPAD-1.5MM  [TEST_PAD-1.5MM]  106.08,45.96 0 bottom
P75  TEST_PADPAD-1.5MM  [TEST_PAD-1.5MM]  83.76,50.4 0 bottom
P76  TEST_PADPAD-1.5MM  [TEST_PAD-1.5MM]  83.76,48 0 bottom
P77  TEST_PADPAD-1.5MM  [TEST_PAD-1.5MM]  83.88,41.76 0 bottom
P78  TEST_PADPAD-1.5MM  [TEST_PAD-1.5MM]  96.12,100.44 0 bottom
P79  TEST_PADPAD-1.5MM  [TEST_PAD-1.5MM]  89.28,93.36 0 bottom
P80  TEST_PADPAD-1.5MM  [TEST_PAD-1.5MM]  103.2,91.8 0 bottom
P81  TEST_PADPAD-1.5MM  [TEST_PAD-1.5MM]  101.16,90.36 0 bottom
P82  TEST_PADPAD-1.5MM  [TEST_PAD-1.5MM]  101.04,93 0 bottom
P83  TEST_PADPAD-1.5MM  [TEST_PAD-1.5MM]  93.36,100.44 0 bottom
P84  TEST_PADPAD-1.5MM  [TEST_PAD-1.5MM]  79.08,92.28 0 bottom
P85  TEST_PADPAD-1.5MM  [TEST_PAD-1.5MM]  94.8,4.2 0 bottom
P86  TEST_PADPAD-1.5MM  [TEST_PAD-1.5MM]  80.64,37.44 0 bottom
P87  TEST_PADPAD-1.5MM  [TEST_PAD-1.5MM]  173.35,42.83 0 bottom
P88  TEST_PADPAD-1.5MM  [TEST_PAD-1.5MM]  173.35,40.04 0 bottom
Q1  BSS138W_SOT323  [MOS_SOT323]  171.86,30.05 270 top
Q2  BSS138W_SOT323  [MOS_SOT323]  171.86,33.45 270 top
Q3  NCE20P45Q  [PDFN3333]  158.99,71.95 90 top
Q4  BSS138W_SOT323  [MOS_SOT323]  103.06,97.72 270 top
Q5  NCE20P45Q  [PDFN3333]  158.99,77.48 90 top
Q6  BSS138W_SOT323  [MOS_SOT323]  103.06,94.5 270 top
Q7  BSS138W_SOT323  [MOS_SOT323]  103.06,91.41 270 top
Q8  BSS138W_SOT323  [MOS_SOT323]  133.56,93.11 270 top
Q9  BSS138W_SOT323  [MOS_SOT323]  133.56,96.5 270 top
Q10  AO3401  [PMOS_SOT23]  62.31,24.48 90 top
Q11  AO3401_NC  [PMOS_SOT23]  115.24,22.93 0 top
R1  10K  [R0603]  134.88,75.74 0 top
R2  100K  [R0603]  134.83,81.92 270 top
R3  5.1K  [R0603]  166.62,63.81 0 top
R4  5.1K  [R0603]  166.62,60.45 180 top
R5  10K  [R0603]  153.23,73.2 90 top
R6  0R  [R0603]  156.6,65.96 0 top
R7  0R  [R0603]  156.6,64.53 0 top
R8  0R  [R0603]  145.65,67.19 0 top
R9  10K  [R0603]  148.87,73.25 270 top
R10  0R  [R0603]  145.65,68.66 0 top
R11  22.1K  [R0603]  136.33,81.92 90 top
R12  0R  [R0402]  121.17,75.41 0 top
R13  0R  [R0603]  133.82,66.66 180 top
R14  NC/499K  [R0603]  134.8,73 270 top
R15  10K  [R0603]  13.25,21.14 90 top
R16  2K  [R0603-SP]  153.76,5.3 90 top
R17  5.1K  [R0603]  151.3,13.51 90 top
R18  10K  [R0603]  159.56,74.65 0 top
R19  0R  [R0402]  108.84,75.07 180 top
R20  0R  [R0402]  106.73,75.09 0 top
R21  NC/499K  [R0603]  136.24,72.98 90 top
R22  4.7K  [R0603]  105.25,94.5 270 top
R23  0R  [C0402]  124.16,60.6 270 top
R24  0R  [R0603]  139.32,69.32 90 top
R25  0R  [R0603-SP]  101.65,28.87 90 top
R26  5.1K  [R0603]  172.97,52 90 top
R27  10K  [R0603]  14.75,21.14 90 top
R28  10K  [R0603]  17.95,21.24 90 top
R29  10K  [R0603]  19.42,21.24 90 top
R30  10K  [R0603]  22.53,21.24 90 top
R31  2K  [R0603-SP]  167,54.86 180 top
R32  2K  [R0603-SP]  167,56.39 180 top
R33  10K_NC  [R0603]  20.97,21.24 270 top
R35  NC/10M  [R0402]  104.83,72.32 90 top
R36  0R  [R0402]  104.29,67.94 90 top
R37  0R  [R0402]  104.29,63.26 90 top
R38  0R  [R0402]  106.39,55.64 180 top
R39  0R  [R0402]  124.13,64.52 270 top
R40  0R  [R0402]  124.15,62.48 90 top
R41  0R  [R0402]  112.3,75.74 180 top
R42  0R  [R0402]  104.29,60.48 270 top
R43  0R  [R0402]  124.48,73.12 90 top
R44  0R  [R0402]  114.4,75.7 0 top
R45  4.7K  [R0603]  169.75,33.45 270 top
R46  4.7K  [R0603]  173.95,33.45 90 top
R47  5.1K  [R0603]  152.37,5.32 270 top
R48  0R  [R0603]  139.83,100.85 180 top
R49  0R  [R0603]  139.84,99.34 180 top
R50  5.1K  [R0603]  152.69,13.51 90 top
R51  4.7K  [R0603]  173.94,30.05 270 top
R52  4.7K  [R0603]  169.76,30.05 270 top
R53  10K  [R0603]  113.96,43.4 270 top
R54  10K  [R0603]  11.66,21.18 270 top
R55  0R  [R0603]  145.88,73.23 270 top
R56  4.7K  [R0603]  100.96,94.5 270 top
R57  4.7K  [R0603]  100.96,97.72 270 top
R58  4.7K  [R0603]  105.25,97.73 270 top
R59  4.7K  [R0603]  105.25,91.24 270 top
R60  0R  [R0603]  146.55,76.86 180 top
R61  10K  [R0603]  69.01,96.52 180 top
R62  4.7K  [R0603]  100.96,91.41 270 top
R63  100K  [R0402]  103.06,45.47 270 top
R64  100K  [R0402]  104.05,45.47 90 top
R65  0R  [R0603]  110.72,40.67 0 top
R65_NC  10K  [R0402]  96.94,60.01 90 top
R66  10K  [R0603]  68.93,102.21 180 top
R67  10K  [R0603]  90.74,84.71 180 top
R68  100K  [R0402]  82.26,50.43 90 top
R69  4.7K  [R0603-SP]  117.71,91.56 0 top
R70  0R  [R0402]  124.56,71.17 270 top
R71  10K  [R0603]  64.9,24.48 90 top
R72  10K_NC  [R0402]  32.14,88.09 180 top
R73  10K_NC  [R0402]  32.14,87.15 180 top
R74  4.7K  [R0603]  117.72,93 0 top
R75  4.7K_NC  [R0603]  117.72,94.45 0 top
R76  0R  [R0603]  7.06,67.6 270 top
R77  10K  [R0603]  12.28,67.6 270 top
R78  4.7K  [R0603]  159.49,80.07 0 top
R79  OR_NC  [R0603-SP]  55.05,14.4 0 top
R80  0R  [R0402]  113.69,55.63 0 top
R81  51K  [R0603]  17.54,67.64 90 top
R82  51K  [R0603]  18.94,67.64 90 top
R83  51K  [R0603]  20.36,67.64 90 top
R84  51K  [R0603]  21.79,67.64 90 top
R85  51K  [R0603]  23.21,67.64 90 top
R86  51K  [R0603]  24.64,67.64 90 top
R87  10K  [R0603]  16.13,67.64 90 top
R88  0R  [R0402]  76.96,68.07 0 top
R89  0R  [R0402]  76.96,66.29 0 top
R90  0R  [R0402]  76.96,67.18 0 top
R91  10K  [R0603]  147.34,73.23 90 top
R92  0R  [R0402]  111.53,53.43 90 top
R93  4.7K  [R0603]  135.96,96.39 270 top
R94  4.7K  [R0603]  135.95,93.3 270 top
R95  0R  [R0402]  109.73,53.43 90 top
R96  5.1K  [R0603]  166.51,43.36 0 top
R97  4.7K  [R0603]  117.72,97.47 0 top
R98  4.7K  [R0603]  117.72,95.97 0 top
R99  0R  [R0402]  108.83,53.43 90 top
R100  0R  [R0402]  110.33,56.23 90 top
R101  5.1K  [R0603]  166.51,40.29 180 top
R102  0R  [R0402]  111.23,56.23 90 top
R103  0R  [R0603]  137.71,72.97 90 top
R104  4.02K  [R0402]  108.23,56.27 90 top
R105  0R  [R0402]  102.43,60.01 90 top
R106  10K  [R0603]  146.55,75.43 0 top
R107  0R_NC  [R0402]  101.48,60.01 90 top
R108  100K  [R0402]  83.23,50.43 270 top
R109  0R  [R0402]  117.35,75.43 0 top
R110  0R_NC  [R0402]  125.15,60.59 270 top
R111  0R_NC  [R0402]  76.88,61.03 180 top
R112  0R  [R0603]  63.52,17.36 270 top
R113  0R  [R0603]  150.36,30.36 0 top
R114  0R  [R0603]  150.36,31.76 0 top
R115  0R  [R0603]  150.36,28.96 0 top
R116  10K  [R0603]  143.34,62.7 0 top
R117  100K  [R0603]  150.38,27.53 180 top
R118  0R  [R0603]  138.64,41.66 90 top
R119  0R  [R0603]  137.24,41.66 90 top
R120  5.1K_NC  [R0603]  167,57.91 180 top
R121  5.1K_NC  [R0603]  167.01,53.41 180 top
R122  100K  [R0402]  85.28,50.43 90 top
R123  100K  [R0402]  84.31,50.43 270 top
R124  0R_NC  [R0402]  32.14,89.04 180 top
R125  0R_NC  [R0402]  32.14,89.98 180 top
R126  0R_NC  [R0402]  121.33,53.44 270 top
R127  0R  [R0402]  122.27,53.44 270 top
R128  0R_NC  [R0402]  76.88,61.97 180 top
R129  0R  [R0603]  64.98,17.36 270 top
R130  0R_NC  [R0402]  76.88,62.86 180 top
R131  10K  [R0402]  9.66,89.39 0 top
R132  OR  [R0402]  9.66,88.43 180 top
R134  OR  [R0402]  6.48,88.46 270 top
R139  100K  [R0603]  61.93,17.31 90 top
R141  OR_NC  [R0402]  9.66,92.27 0 top
R142  OR_NC  [R0402]  9.66,93.27 0 top
R143  51K  [R0603-SP]  67.95,17.36 270 top
R144  OR_NC  [R0402]  7.37,88.46 90 top
R145  OR_NC  [R0402]  9.66,91.31 0 top
R146  0R_NC  [R0402]  22.26,78.29 180 top
R147  OR_NC  [R0603-SP]  43.45,14 0 top
R148  0R_NC  [R0402]  22.26,79.22 180 top
R149  0R  [R0603]  66.49,17.36 270 top
R152  100R  [R0402]  114.87,53.45 270 top
R153  100R  [R0402]  115.72,53.45 270 top
R154  100R  [R0402]  117.65,53.45 270 top
R155  100R  [R0402]  118.54,53.45 270 top
R156  100R  [R0402]  117.08,56.15 270 top
R157  100R  [R0402]  116.18,56.15 270 top
R158  4.02K  [R0402]  119.08,56.15 270 top
R159  1.1R  [R0603-SP]  107.68,23.59 270 top
R160  10K  [R0603]  111.28,22.62 180 top
R161  0R_NC  [R0402]  124.74,53.46 270 top
R162  0R  [R0402]  123.79,53.46 270 top
R163  NC  [R0603-SP]  106.28,23.59 270 top
R164  39k  [R0603]  143.85,41.66 90 top
R165  100K  [R0603]  122.33,39.69 0 top
R166  180K  [R0603]  122.49,32.32 270 top
R167  12K  [R0603]  123.93,32.33 90 top
R168  1.91K  [R0402]  86.28,50.42 270 top
R169  1K  [R0402]  89.38,50.42 270 top
R170  0R_NC  [R0402]  29.14,81.78 0 top
R171  10K  [R0402]  9.66,90.35 0 top
R172  220R  [R0603]  109.98,32.96 270 top
R173  51K  [R0603]  106.32,32.96 90 top
R174  220R  [R0603]  110.13,37.47 270 top
R175  51K  [R0603]  106.32,37.47 90 top
R177  0R_NC  [R0402]  29.15,82.73 0 top
R178  20K_NC  [R0603]  55,8.2 0 top
R179  20K_NC  [R0603]  43.45,8.2 180 top
R180  10K  [R0603]  115.24,20.4 0 top
R181  10K  [R0603]  59.03,93.7 270 top
R182  0R  [L0805]  9.56,95.74 270 top
R184  0R  [R0603]  117.64,22.99 90 top
R185  OR_NC  [R0603-SP]  43.45,5.1 0 top
R186  100k  [R0603]  141.52,41.66 270 top
R187  10k  [R0603]  139.02,54.18 270 top
R188  0R  [R0603]  142.11,54.23 270 top
R189  0R  [R0603]  143.64,54.23 270 top
R190  0R  [R0402]  112.42,53.43 90 top
R210  NC/10K  [R0603]  136.78,66.65 180 top
R216  0R  [R0402]  98.22,71.79 90 top
R217  0R  [R0402]  96.37,71.78 90 top
R332  0R  [R0402]  97.3,71.78 90 top
SW1  switch_6pin  [SWITCH_6PIN_2P]  172.09,79.45 90 top
TP1  TPTP08R  [TP08R]  86.38,95.3 0 bottom
TP2  TPTP08R  [TP08R]  87.61,95.3 0 bottom
TP3  TPTP08R  [TP08R]  83.28,95.28 0 bottom
TP4  TPTP08R  [TP08R]  84.72,95.28 0 bottom
TP5  TPTP08R  [TP08R]  84.84,93.48 0 bottom
TP6  TPTP08R  [TP08R]  86.16,93.48 0 bottom
TP7  TPTP08R  [TP08R]  94.4,43.2 0 bottom
TP8  TPTP08R  [TP08R]  93,43.2 0 bottom
TP9  TPTP08R  [TP08R]  91.6,43.2 0 bottom
TP10  TPTP08R  [TP08R]  90.2,43.2 0 bottom
TP11  TPTP08R  [TP08R]  91.2,48.48 0 bottom
TP12  TPTP08R  [TP08R]  90,48.48 0 bottom
U1  CH340K  [ESOP-10-EP-150MIL]  151.17,68.27 180 top
U2  TP4059-SOT23-6  [SOT23-6L]  152.32,9.3 180 top
U3  NS4168  [NS4168-ESOP-8]  154.89,28.22 270 top
U4  NS4263B  [SOP16]  46.5,14.3 270 top
U6  MT9201  [COOPER_SOT23-6]  111.28,25.13 270 top
U7  ESP32-P4NRW32  [IC_ESP32-P4NRW32]  113.14,66.12 0 top
U8  UMH3NTN  [SOP65P210X100-6N]  151.09,73.27 90 top
U9  MT3406_C22462728  [SOT95P280X145-5N]  134.94,78.26 0 top
U10  MT3406_C22462728  [SOT95P280X145-5N]  134.8,69.36 0 top
U13  NS4168  [NS4168-ESOP-8]  64.56,11.22 270 top
U14  STC8H1K08-36I  [TSSOP20]  140.81,48.1 270 top
U16  MT3608  [SOT95P280X145-6N]  122.3,36.75 90 top
U176  LMA3526B381  [MIC-SMD_5P-L3.5-W2.7-P1.67]  3.04,92.12 270 top
U$113  [P4-LCD-7.0-BK3]  0,0 0 top
Y2  40MHZ  [X322540MPB4SI]  108.74,79.08 0 top
Y3  24Mhz  [24MHZ_1631-24003-BTKEYA]  90.76,87.67 90 top
Y4  32.768K  [NORDIC_NRF_XTAL_3215_N]  102.26,72.58 270 top

## Tracks (layer width: path | path; a pad name or v marks a point on that pad's centre or on a via)
3V3$
  Top 0.406: C2.2 146.99,66.27 U1.10
13
  Top 0.12: R189.2 142.14,51.97 141.78,51.62 U14.3
14
  Top 0.12: U14.4 141.13,52.48 R188.2
+5V_IN  (via drill 0.4 pad 0.8)
  Top 0.305: R51.1 172.11,30.81 171.8,30.5 171.8,28.8 171.4,28.4 166.26,28.4 165.76,28.89
  Top 0.406: R46.1 R51.1
  Top 0.813: J10.3 168.9,18.6 v172.32,18.6
  Top 2: J10.3 164.55,18.55 163.93,19.17 163.93,28.76 D4.+ 165.76,28.89 D2.+
  Bottom 0.813: P66.P$1 v172.32,18.6
+VBUS1  (via drill 0.35)
  Top 0.305: J1.B4 168.38,64.72 168.1,65 | 168,65.1 168.08,65.02 J1.A9 170.91,65.02 171.72,64.22 | J1.B4 | J1.B4 170.81,64.72 171.32,64.22 171.47,64.22 171.72,64.22 | J1.B9 170.82,60.22 171.26,60.67 171.26,61.13 171.4,60.99 171.43,60.96 171.59,60.8 170.71,59.92 J1.A4 | 171.72,64.22 171.8,64.13
  Top 0.508: 171.8,63.76 171.47,64.09 171.47,64.22
  Top 0.61: 171.8,64.13 171.8,63.76 v171.8,63.37 171.8,61.33 171.43,60.96
  Top 1: 168,65.1 168.1,65
  Bottom 0.508: v171.8,63.37 172.17,63.75 173.2,63.75
  Bottom 0.813: 173.2,63.75 P1.P$1
  pour Top (no thermals): 165.49,64.61 168.28,64.61 168.48,64.8 168.48,66.04 168.35,66.17 165.55,66.17 165.42,66.04 165.36,65.97 165.36,64.67 165.42,64.61
+VBUS2  (via drill 0.35)
  Top 0.305: J16.B4 168.88,43.82 168.72,43.98 168.58,44.12 J16.A9 170.96,44.12 171.5,43.58 171.5,43.4 171.4,43.3 170.88,43.82 J16.B4 | J16.B4 168.66,43.82 168,44.48 | 171.4,39.6 171.3,39.6 171.02,39.32 | 171.02,39.32 171.32,39.32 171.02,39.02 J16.A4 | 171.02,39.32 J16.B9
  Top 0.61: 171.4,43.3 171.5,43.2 v171.5,42.77 171.5,39.7 171.4,39.6 | 168.72,43.98 168.56,43.98 D007.+
  Bottom 0.152: 173.22,42.83 P87.P$1
  Bottom 0.813: v171.5,42.77 171.56,42.83 173.22,42.83
  pour Top (no thermals): 165.36,44.33 168.15,44.33 168.35,44.52 168.35,45.76 168.22,45.89 165.42,45.89 165.29,45.76 165.23,45.69 165.23,44.39 165.29,44.33
ADC_AVDD_3V3
  Top 0.203: IC5.22 24.93,88.93 24.7,88.7 | IC5.23 24.97,88.53 24.8,88.7
  Top 0.508: FB5.2 23.25,87.3 C133.2 C132.1 24.33,88.23 24.8,88.7 24.7,88.7
ADC_DVDD_3V3  (via drill 0.3 pad 0.6)
  Top 0.2: IC5.7 30.61,90.53 30.64,90.5 30.27,90.13 IC5.6
  Top 0.254: v34.49,87 34.77,87.28 34.77,90.24 34.11,90.9 32.99,90.9 32.98,90.89 32.24,90.89 31.71,91.42 C130.1 | R73.1 32.73,87 v33.24,87
  Top 0.406: FB4.2 31.74,92.43 C131.2 | 31.61,91.47 C130.1 30.74,90.5 30.64,90.5
  Top 0.508: C131.2 31.73,91.49 C130.1
  Bottom 0.254: v33.24,87 v34.49,87
ADC_VBAT
  Top 0.152: 140.16,42.42 C158.2
  Top 0.406: R164.2 R186.1 140.16,42.42 | C158.2 138.59,43.87 U14.13
AGND  (via drill 0.3 pad 0.6)
  Top 0.508: J4.P$4 v34.09,8.81 v34.1,8.8
  other vias: 37.7,8.8 42.6,4.1 48.1,6.4 55.9,4.1 53.3,12.9 45.2,12.9 45.4,16 45.6,17.8 57,14.4 63.4,11.9 64.5,11.9 65.7,11.9 63.4,11 64.6,11 65.7,11 58.8,15.1 65.2,7.1 63.6,7.1 64.4,7.1 67.9,19.2 60.4,19.1 53.6,19.3 52.1,19.3 50.8,19.4 58.9,11.4 68.2,14.4 68.2,8.1 60,6.6 48.8,3.5 33,5.9 33.9,11.8 40.5,11.9 47.4,19.1 47.4,16.1
  pour Bottom (rank 2, no thermals): 31.4,2.9 31.4,10.8 33.7,13.1 41.2,13.1 43.7,15.6 43.7,18.6 45,19.9 68.8,19.9 69.6,19.1 69.6,7.7 66.9,5 61.1,5 57.9,1.8 42.2,1.8 41.7,1.3 33,1.3
  pour Top (rank 2, no thermals): 43.7,15.6 43.7,18.6 45,19.9 68.7,19.9 69.6,19 69.6,7.7 66.9,5 61.2,5 58,1.8 42.2,1.8 41.7,1.3 33,1.3 31.4,2.9 31.4,10.9 33.6,13.1 41.2,13.1
AGND1  (via drill 0.3 pad 0.6)  (1 unrouted)
  Top 0.12: R145.2 10.89,91.31 v10.9,91.3 | IC5.21 25.68,89.34 24.24,89.34 v24.1,89.2
  Top 0.2: IC6.10 27.67,79.13 v27.5,79.3
  Top 0.508: U176.5_2 1.66,91.94 2.4,91.2 v2.4,90.5
  Bottom 0.61: v34.4,79 v34.4,78.2 34.4,76.8 v33.8,76.2 v33.3,75.7
  other vias: 8.2,87.9 10.9,90.3 21.4,92 21.4,91.1 21.4,88.4 21.4,87.3 24,83.7 24.9,83.7 25.9,83.7 27,83.7 23.3,80.4 23.4,77.2 23.4,76.2 4.4,87.2 12.2,88.8 17.6,88.7 15.1,90.5 20.2,90.3 11.1,94 7.5,94.7 3.9,95 7,91.6 2.4,88.5 21.2,85 21.2,81.5 21.5,77.2 27.1,74.8
  pour Top (no thermals): 3.6,95.4 10.4,95.4 13.2,92.6 24.4,92.6 25.7,91.3 25.7,87.6 27.5,85.8 27.5,85.1 27.8,84.8 29.3,84.8 29.5,84.6 29.5,84.1 28.3,82.9 28.3,78.7 28.1,78.5 28.1,76.3 29,75.4 32.3,75.4 33.3,76.4 33.3,79.2 33.6,79.5 34.8,79.5 35.1,79.2 35.1,76 33.2,74.1 22.4,74.1 20.7,75.8 20.7,84.7 20.8,84.8 19.8,85.8 4.2,85.8 1.4,88.6 1.4,93.2
  pour Bottom (no thermals): 9.4,95.4 10.4,95.4 11.2,94.6 13.2,92.6 24.1,92.6 24.4,92.6 25.7,91.3 25.7,87.6 27.4,85.9 28,85.3 28,83.9 28.3,83.6 28.3,79.2 28.3,78.7 28.1,78.5 28.1,76.3 28.1,74.7 27.5,74.1 22.4,74.1 20.7,75.8 20.7,84.9 19.9,85.7 19.8,85.8 19.2,85.8 4.3,85.8 1.4,88.7 1.4,93.2 3.6,95.4
AGND2  (via drill 0.3 pad 0.6)
  other vias: 172.6,98
AGND3  (via drill 0.3 pad 0.6)
  Top 0.127: U3.9 v154.89,28.89 v154.9,28.9
  Top 0.508: v159.3,24.1 FB20.2 | C68.1 v154.4,24 | C67.1 155.5,23.33 v155.5,24 155.52,24.02 U3.7 155.52,27.12 v156,27.6 | v148.9,25.6 148.94,25.64 C24.2 C23.2 | C23.2 148.94,24.24 v148.9,24.2 | C23.2 C22.2 v149.01,22.81 v149,22.8 | v158.9,9.5 158.27,9.5 J6.P$4 158.29,8.81 v159,8.1 | v162.9,9.5 163.59,8.81 J6.P$3 163.61,8.81 v163,8.2
  Top 0.61: C68.1 C67.1
  other vias: 153.8,28.9 156,28.9 153.8,27.6 154.9,27.6
  pour Bottom (no thermals): 157.1,29.8 153.7,29.8 150.5,26.6 148.5,26.6 148,26.1 148,21.9 148.3,21.6 152.88,21.6 158.2,16.28 158.2,7.5 158.9,6.8 163.6,6.8 164,7.2 164,14.18 158.6,19.58 158.6,28.3
  pour Top: 148.12,21.25 148.12,30.74 150.28,32.9 156.7,32.9 157.8,31.8 157.8,29.1 159.8,27.1 159.8,22.6 159.5,22.3 158.7,22.3 158.5,22.1 158.5,21.3 158.6,21.2 158.6,19.7 164.06,14.24 164.06,11.84 165.4,10.5 165.4,7 164.8,6.4 156.7,6.4 156.1,7 156.1,10.1 158.2,12.2 158.2,16.32 154.12,20.4 148.97,20.4
AUDIO_CTRL  (via drill 0.35)
  Top 0.12: v81.88,21.56 v81.89,21.56 85.13,18.32 107.85,18.32 115.37,10.8 133.25,10.8 136.66,14.21 136.66,27.5 v136.33,27.83 | v148.46,27.25 149.34,27.25 R117.2
  Top 0.127: 61.9,18.1 R139.2 61.93,21.15 v61.38,21.7 61.29,21.79 Q10.3
  Bottom 0.12: v81.88,21.56 81.74,21.7 v61.38,21.7 | v136.33,27.83 136.53,28.03 147.8,28.03 148.46,27.37 v148.46,27.25
AUDIO_OUT_5V  (via drill 0.3 pad 0.6)
  Top 0.61: 53.63,16.63 C148.2 53.67,16.63 | 50.1,11 v50.3,10.8 50.61,10.49 U4.13 | U4.4 v47.9,10.5
  Top 0.813: 53.63,16.63 C134.2 C154.1 50.1,15.98 50.1,12.3 50.1,11 | FB15.2 53.67,16.63
  Bottom 0.61: v50.3,10.8 50,10.5 v47.9,10.5 47.9,11.1 v48,11.2 49.8,11.2 v50,11.4
  pour Bottom: 47.7,11.5 49.5,11.5 49.7,11.7 49.8,11.8 50.3,11.8 50.6,11.5 50.8,11.3 50.8,10.7 50.1,10 47.8,10 47.4,10.4 47.4,11.3 47.6,11.5
  pour Top (no thermals): 46.5,10.8 47.2,10.8 47.3,10.9 47.5,11.1 47.5,11.4 47.8,11.7 47.9,11.7 48.3,11.7 48.5,11.5 48.5,11.4 48.5,10.5 48.4,10.4 48.1,10.1 47.1,10.1 46.5,10.1 46.3,10.3 46.3,10.6
AUDIO_OUT_SD  (via drill 0.3 pad 0.6, 0.35)
  Top 0.12: U7.60 119.3,64.19 119.81,63.68 119.81,60.02 124.15,55.68 126.71,55.68 130.05,52.34 130.05,37.59 132.21,35.43 137.71,35.43 141.35,31.8 141.35,14.05 133.78,6.48 113.37,6.48 105,14.85 81.81,14.85 74.36,22.3 v74,22.3 | v48,20.7 48.2,20.5 48.2,15.3 47.9,15 43.6,15 42.69,14.09 R147.1
  Top 0.127: v63.27,22.37 63.32,22.41 Q10.1 63.45,23.72 R71.1
  Bottom 0.12: v74,22.3 73.95,22.35 63.29,22.35 | v48,20.7 48.1,20.8
  Bottom 0.127: 63.29,22.35 v63.27,22.37 49.67,22.37 48.1,20.8
AUDIO_VDD1
  Top 0.508: C104.1 60.43,16.49 | 61.6,9.7 63.1,9.7 63.92,8.87 U13.6
  Top 0.813: FB17.1 C104.1 | 60.43,16.49 C102.1 C103.1 60.43,10.87 61.6,9.7
AUDIO_VDD2
  Top 0.508: C24.1 151.17,25.77 | 152.1,26.7 153.8,26.7 154.25,26.24 U3.6
  Top 0.6: C23.1 C24.1
  Top 0.8: FB18.1 C22.1 C23.1 | 151.17,25.77 152.1,26.7
AUDIO_VDD_3V3  (via drill 0.3 pad 0.6)
  Top 0.508: FB6.1 5.4,87.32 5.92,86.8 18.4,86.8 v18.7,86.5 | v21,86.6 21.19,86.41 FB5.1 22.36,84.14 24,82.5 25.73,82.5 27.18,81.05 29.97,81.05 33.19,84.26 v33.19,84.31
  Top 0.61: IC7.5 54.45,92.95 C152.2 C153.2 FB16.2 40.45,92.95 v39.9,93.5 | FB4.1 32.65,93.38 32.87,93.38 33.69,92.57 v33.87,92.57 35.3,91.13 35.3,83.53 v34.73,82.97 33.58,81.81 FB14.1 | v18.7,86.5 19,86.2 v19,85.8
  Bottom 0.508: v18.7,86.5 20.9,86.5 v21,86.6 | v34.73,82.97 34.53,82.97 v33.19,84.31
  Bottom 0.61: v40.4,93 v39.9,93.5 34.8,93.5 v33.87,92.57 33.87,92.53 v34.3,92.1 | v35.2,83.4 34.77,82.97 v34.73,82.97 | v33.19,84.31 32.7,83.82 v32.7,83.8 | v21,86.6 21.2,86.4 v21.6,86.4
AVDD_2V8  (via drill 0.35)
  Top 0.3: FPC3.2 93.75,94.38 93.98,94.61 94.25,94.34 FPC3.1
  Top 0.61: IC3.5 73.42,100.55 C82.2 C83.2 76.99,100.36 | 76.99,100.36 v77.34,100.71 | v77.34,100.08 77.06,100.36 76.99,100.36 | 92.46,98.17 92.46,96.9 93.98,95.38 93.98,94.61 | 92.46,98.17 v92.08,98.55 v92.07,98.55 | 92.46,98.17 v92.84,98.55
  Bottom 0.508: P83.P$1 93.25,100.33 91.69,100.33
  Bottom 0.61: 92.46,98.93 92.46,99.56 91.69,100.33 77.6,100.33 | v92.07,98.55 92.46,98.93 | 92.46,98.93 v92.84,98.55 | v77.34,100.08 77.6,100.33 | 77.6,100.33 77.6,100.46 v77.34,100.71
C6_EN  (via drill 0.3 pad 0.6)
  Top 0.12: U7.63 119.08,65.24 119.29,65.46 119.82,65.46 120.34,64.94 120.34,60.11 124.15,56.3 126.9,56.3 130.81,52.39 130.81,37.85 132.59,36.07 138.28,36.07 141.92,32.43 141.92,13.9 133.83,5.82 112.32,5.82 103.55,14.58 80.72,14.58 73.12,22.18 73.12,51.18 65.1,59.2 33.6,59.2 27.4,65.4 v27.4,70.5 | v15.4,69.7 15.16,69.7 C15.1 12.3,68.36 | 12.3,68.36 R77.1 | IC1.8 12.51,68.57 12.3,68.36
  Bottom 0.12: v27.4,70.5 27.2,70.3 25.8,70.3 24.8,71.3 17,71.3 v15.4,69.7
C6_IO8
  Top 0.12: IC1.22 16.38,80.52 16.68,80.22 16.68,69.75 16.13,69.2 R87.2
C6_IO9_BOOT  (via drill 0.35)
  Top 0.152: IC1.23 15.2,81.32 v14.73,81.79
  Bottom 0.152: v14.73,81.79 14.73,82.95 P36.P$1
C6_RXD0  (via drill 0.3 pad 0.6)
  Top 0.12: IC1.30 10.91,83.91 v11.3,84.3
  Bottom 0.12: v11.3,84.3 12.26,83.34 P21.P$1
C6_TXD0  (via drill 0.3 pad 0.6)
  Top 0.12: IC1.31 v10.11,84.29 v10.1,84.3
  Bottom 0.12: v10.1,84.3 10.1,83.58 P25.P$1
C6_VDD_3V3  (via drill 0.35)
  Top 0.152: v10.03,69.47 9.98,69.42 C14.2
  Top 0.508: IC1.3 8.51,68.41 C11.1 | C14.2 11.5,66.84 R77.2 13.52,65.6 14.85,65.6 R87.1 R81.1 R82.1 R83.1 R84.1 R85.1 R86.1
  Top 0.61: R76.1 C11.1 C14.2
  Bottom 0.152: P37.P$1 10.54,69.98 v10.03,69.47
CODEC_3V3  (via drill 0.3 pad 0.6)
  Top 0.2: IC6.4 31.47,78.03 v31.5,78 31.13,77.63 IC6.3 | FB13.2 24.32,81.32 24.71,81.71 25.69,81.71 26.87,80.53 v30.57,80.53
  Top 0.406: FB14.2 C145.1 32.69,78.23 C146.2 32.49,78 v31.5,78
  Bottom 0.2: v31.5,78 32,78.5 32,79.4 30.87,80.53 v30.57,80.53
CSI_CLK_N  (via drill 0.35)
  Top 0.12: v85.15,68.83 85.39,69.08 85.39,92.2 85.25,92.34 FPC3.19 85.25,94.39 v85.12,94.52 | R156.2 116.74,55.37 116.74,52.45 v116.98,52.21 v116.98,52.2
  Bottom 0.12: v85.15,68.83 85.39,68.59 85.39,59.45 93.37,51.47 113.25,51.47 114.01,50.7 116.1,50.7 116.74,51.34 116.74,51.95 v116.98,52.2 | v85.12,94.52 85.12,93.76 TP5.TP
CSI_CLK_P  (via drill 0.35)
  Top 0.12: v85.85,68.83 85.61,69.08 85.61,92.2 85.75,92.34 FPC3.18 85.75,94.42 v85.85,94.52 | R157.2 116.52,55.37 116.52,52.44 v116.28,52.2
  Bottom 0.12: v85.85,68.83 85.61,68.59 85.61,59.54 93.46,51.69 113.34,51.69 114.1,50.93 116.01,50.93 116.52,51.43 116.52,51.95 v116.28,52.2 | v85.85,94.52 85.85,93.8 TP6.TP
CSI_D0_N  (via drill 0.35)
  Top 0.12: R152.2 115.18,52.7 115.18,52.06 v114.94,51.56 | v86.65,68.5 86.89,68.74 86.89,92.2 86.75,92.34 FPC3.16 86.75,94.4 v86.64,94.51
  Bottom 0.12: v86.65,68.5 86.89,68.26 86.89,59.21 93.87,52.23 115.16,52.23 115.19,52.2 115.19,51.94 115.06,51.69 v114.94,51.56 | v86.64,94.51 86.64,95.05 TP1.TP
CSI_D0_P  (via drill 0.35)
  Top 0.12: R153.2 115.4,52.7 115.4,51.82 115.65,51.57 v115.65,51.56 | v87.35,68.5 87.11,68.74 87.11,92.2 87.25,92.34 FPC3.15 87.25,94.41 v87.35,94.51
  Bottom 0.12: v87.35,68.5 87.11,68.26 87.11,59.3 93.96,52.45 115.25,52.45 115.41,52.29 115.41,52.07 115.65,51.83 v115.65,51.56 | v87.35,94.51 87.35,95.04 TP2.TP
CSI_D1_N  (via drill 0.35)
  Top 0.12: v83.65,68.2 83.89,68.44 83.89,92.2 83.75,92.34 FPC3.22 83.75,94.4 v83.63,94.52 | R154.2 117.98,52.68 117.98,50.42 118.24,50.16 118.42,50.16 v118.74,49.84
  Bottom 0.12: v83.65,68.2 83.89,67.96 83.89,59.67 92.85,50.7 112.74,50.7 113.38,50.07 118.51,50.07 v118.74,49.84 | v83.63,94.52 83.63,94.9 83.28,95.26 TP3.TP
CSI_D1_P  (via drill 0.35)
  Top 0.12: v84.35,68.2 84.11,68.44 84.11,92.2 84.25,92.34 FPC3.21 84.25,94.39 v84.37,94.51 | R155.2 118.2,52.68 118.2,50.58 118.36,50.42 118.62,50.42 v118.74,50.55
  Bottom 0.12: v84.35,68.2 84.11,67.96 84.11,59.76 92.94,50.93 112.83,50.93 113.47,50.29 118.49,50.29 v118.74,50.55 | TP4.TP 84.37,94.93 v84.37,94.51
CSI_RESET  (via drill 0.35)
  Top 0.12: Q4.2 101.09,97.09 R57.2 100.84,96.96 100.84,96.26 100.3,95.73 100.3,93.64 99.33,92.67 99.33,91.23 v99.45,91.11 | FPC3.8 90.76,93.31 90.76,92.49 | 91.1,92.33 92.12,92.33 93.01,91.44 95.51,91.44 v96.1,90.86
  Top 0.127: 91.1,92.33 90.93,92.33 90.76,92.49
  Bottom 0.12: v96.1,90.86 96.14,90.9 99.24,90.9 v99.45,91.11 v99.45,91.1 100.3,91.1 101,91.8 P80.P$1
CSI_SCL  (via drill 0.35)
  Top 0.12: R62.2 101.09,90.78 Q7.2 | FPC3.4 92.75,92.57 93,92.33 96.52,92.33 97.16,91.69 97.16,90.85 v96.68,90.37 | 100.96,90.81 R62.2 | R62.2 99.93,90.65 v99.69,90.41
  Bottom 0.12: v96.68,90.37 96.92,90.37 97.06,90.51 99.58,90.51 v99.69,90.41 101.11,90.41 P81.P$1
CSI_SDA  (via drill 0.35)
  Top 0.12: Q6.2 102.04,93.74 R56.2 | 100.95,93.73 R56.2 | FPC3.5 92.26,93.31 92.26,92.61 93.03,91.84 96.22,91.84 v96.59,91.47 | v99.91,91.76 99.91,91.88 100.27,92.24 100.27,93.07 100.93,93.74 R56.2
  Bottom 0.12: v96.59,91.47 96.83,91.71 99.86,91.71 v99.91,91.76 101.04,92.89 P82.P$1
CSID0_P
  Top 0.12: R153.1 115.72,54.09 115.39,54.42 115.39,58.82 114.36,59.85 U7.43
DA1  (via drill 0.3 pad 0.6)
  Top 0.12: J5.8 v13.92,16.44 13.92,19.71 R15.1
  Bottom 0.127: P56.P$1 13.56,16.8 v13.92,16.44
DA2  (via drill 0.3 pad 0.6)
  Top 0.12: J5.1 21.62,18.05 22.53,18.96 v22.53,19.08 R30.1
  Bottom 0.127: P53.P$1 22.56,19.11 v22.53,19.08